# Altium schematic sheet rev02_21.SchDoc
size 282 x 200 mm
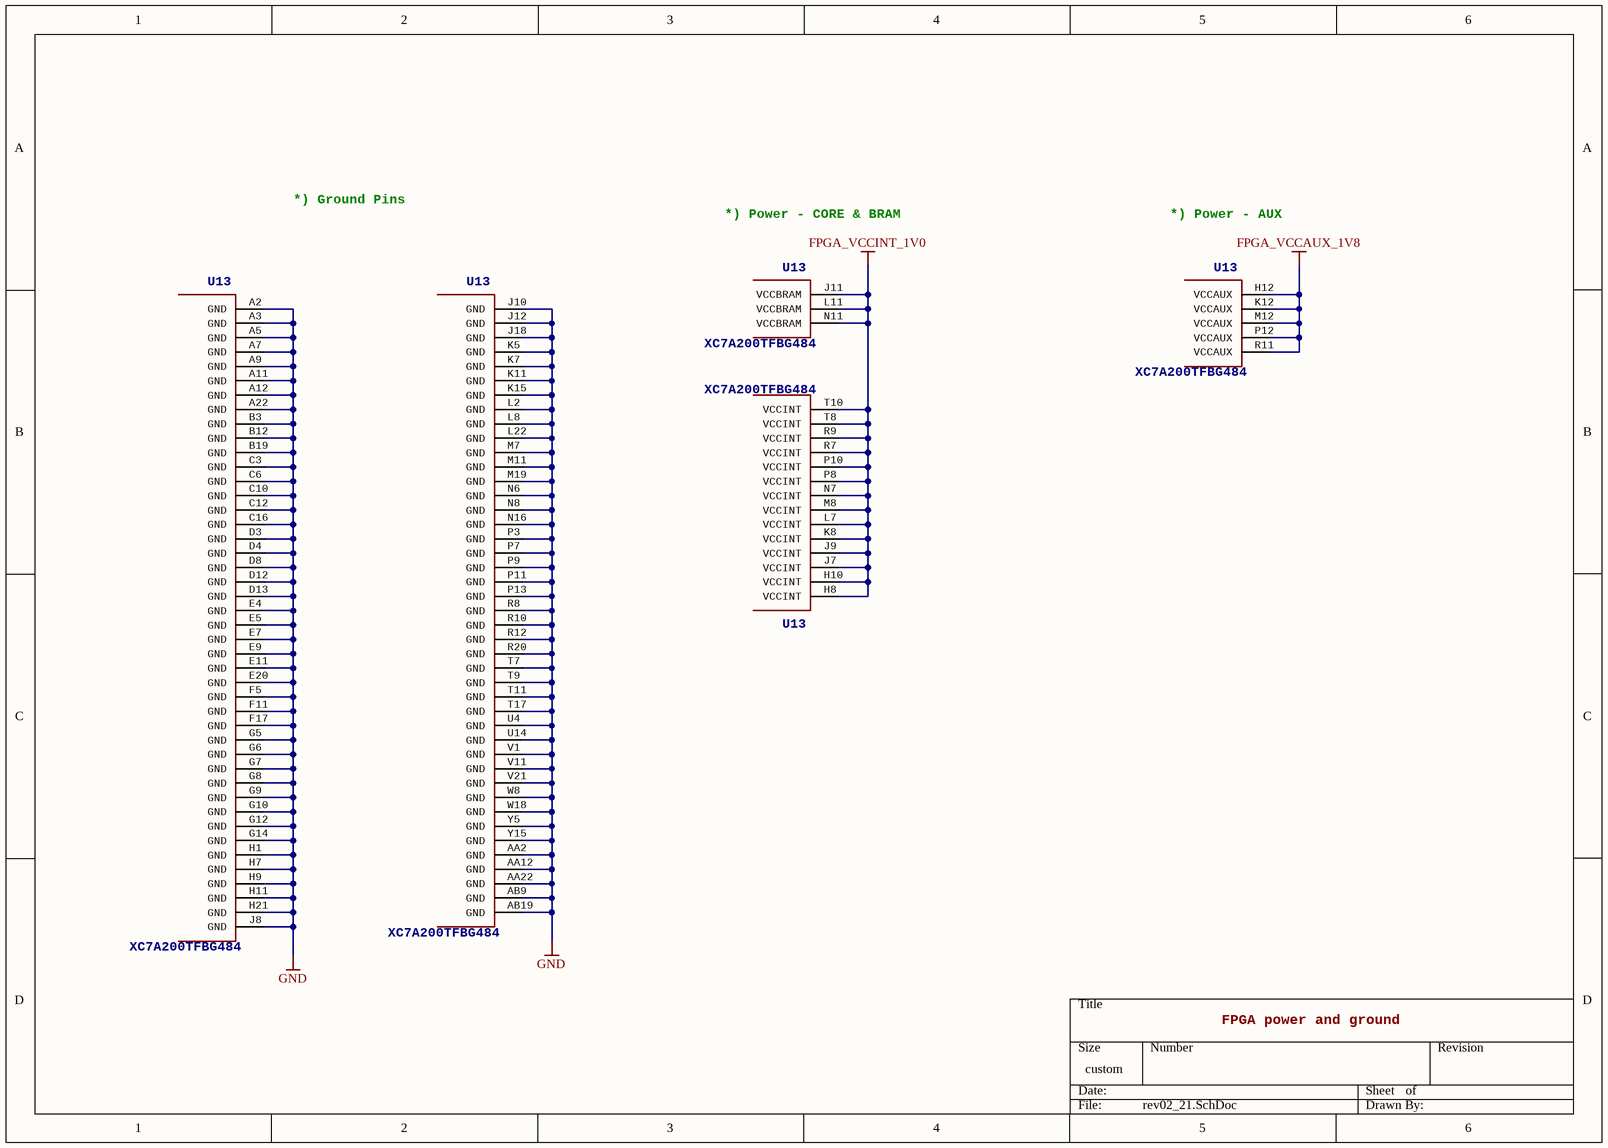
[diagram p0: rev02_21.SchDoc]

## Parts
U13  >NAME: U13  [BGA484C100P22X22_2300X2300X254]  (hidden comment: XC7A200TFBG484)  (parts I,J,N,O,P of 17)

## Nets
FPGA_VCCAUX_1V8: U13.H12(VCCAUX) U13.K12(VCCAUX) U13.M12(VCCAUX) U13.P12(VCCAUX) U13.R11(VCCAUX)
FPGA_VCCINT_1V0: U13.H8(VCCINT) U13.H10(VCCINT) U13.J7(VCCINT) U13.J9(VCCINT) U13.J11(VCCBRAM) U13.K8(VCCINT) U13.L7(VCCINT) U13.L11(VCCBRAM) U13.M8(VCCINT) U13.N7(VCCINT) U13.N11(VCCBRAM) U13.P8(VCCINT) U13.P10(VCCINT) U13.R7(VCCINT) U13.R9(VCCINT) U13.T8(VCCINT) U13.T10(VCCINT)
GND: U13.A2(GND) U13.A3(GND) U13.A5(GND) U13.A7(GND) U13.A9(GND) U13.A11(GND) U13.A12(GND) U13.A22(GND) U13.AA2(GND) U13.AA12(GND) U13.AA22(GND) U13.AB9(GND) U13.AB19(GND) U13.B3(GND) U13.B12(GND) U13.B19(GND) U13.C3(GND) U13.C6(GND) U13.C10(GND) U13.C12(GND) U13.C16(GND) U13.D3(GND) U13.D4(GND) U13.D8(GND) U13.D12(GND) U13.D13(GND) U13.E4(GND) U13.E5(GND) U13.E7(GND) U13.E9(GND) U13.E11(GND) U13.E20(GND) U13.F5(GND) U13.F11(GND) U13.F17(GND) U13.G5(GND) U13.G6(GND) U13.G7(GND) U13.G8(GND) U13.G9(GND) U13.G10(GND) U13.G12(GND) U13.G14(GND) U13.H1(GND) U13.H7(GND) U13.H9(GND) U13.H11(GND) U13.H21(GND) U13.J8(GND) U13.J10(GND) U13.J12(GND) U13.J18(GND) U13.K5(GND) U13.K7(GND) U13.K11(GND) U13.K15(GND) U13.L2(GND) U13.L8(GND) U13.L22(GND) U13.M7(GND) U13.M11(GND) U13.M19(GND) U13.N6(GND) U13.N8(GND) U13.N16(GND) U13.P3(GND) U13.P7(GND) U13.P9(GND) U13.P11(GND) U13.P13(GND) U13.R8(GND) U13.R10(GND) U13.R12(GND) U13.R20(GND) U13.T7(GND) U13.T9(GND) U13.T11(GND) U13.T17(GND) U13.U4(GND) U13.U14(GND) U13.V1(GND) U13.V11(GND) U13.V21(GND) U13.W8(GND) U13.W18(GND) U13.Y5(GND) U13.Y15(GND)

## Notes on the sheet
- *) Ground Pins
- *) Power - CORE & BRAM
- *) Power - AUX
- FPGA power and ground

## Library data of the parts
U13 = XC7A200TFBG484: Xilinx FPGA: XC7A200TFBG484; MPN: XC7A200T-1FBG484C; MFR: Xilinx; OC_DIGIKEY: 122-1871-ND; >VALUE: XC7A200TFBG484